# EAGLE design SparkFun RTK Facet - Display SD SIM (EAGLE 9.6.2)
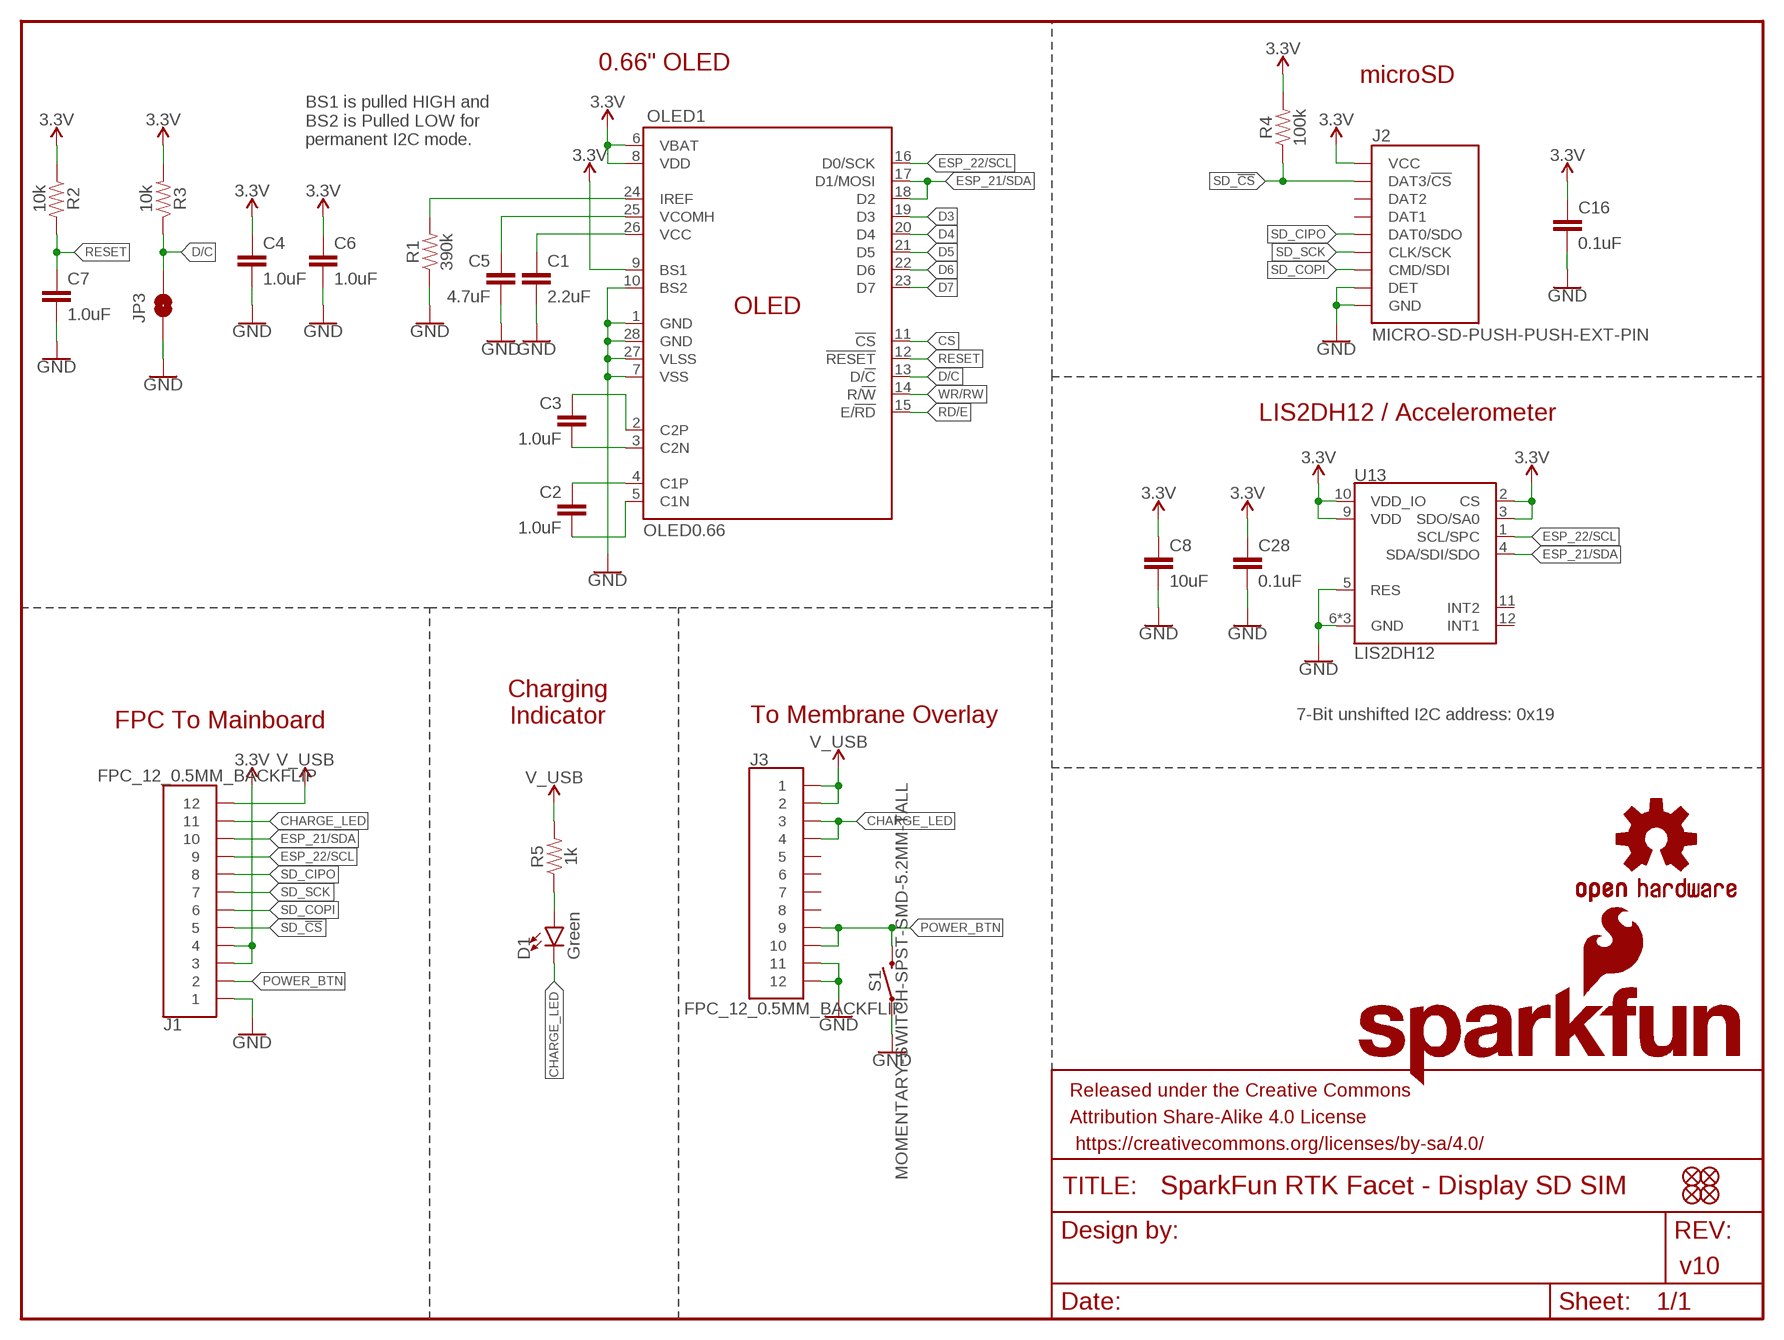
[diagram p0: schematic, sheet 1]

## Parts
C1  2.2uF  2.2UF-0805-25V-(+80/-20%)  [0805]
C2  1.0uF  1.0UF-0805-25V-10%  [0805]
C3  1.0uF  1.0UF-0805-25V-10%  [0805]
C4  1.0uF  1.0UF-0603-16V-10%  [0603]
C5  4.7uF  4.7UF-1206-16V-(+80/-20%)  [1206]
C6  1.0uF  1.0UF-0603-16V-10%  [0603]
C7  1.0uF  1.0UF-0603-16V-10%  [0603]
C8  10uF  10UF-0603-6.3V-20%  [0603]
C16  0.1uF  0.1UF-0603-25V-(+80/-20%)  [0603]
C28  0.1uF  0.1UF-0603-25V-(+80/-20%)  [0603]
D1  Green  LED-GREEN1206-BOTTOM  [LED-1206-BOTTOM]
FID1  FIDUCIAL1X2  [FIDUCIAL-1X2]
FID2  FIDUCIAL1X2  [FIDUCIAL-1X2]
FID3  FIDUCIAL1X2  [FIDUCIAL-1X2]
FID4  FIDUCIAL1X2  [FIDUCIAL-1X2]
FRAME1  FRAME-LETTER  [CREATIVE_COMMONS]
J1  FPC_12_0.5MM_BACKFLIP  [FPC_12_DOUBLESIDED_BACKFLIP]
J2  MICRO-SD-PUSH-PUSH-EXT-PIN  [MICROSD-EXTERNALPIN]
J3  FPC_12_0.5MM_BACKFLIP  [FPC_12_DOUBLESIDED_BACKFLIP]
JP3  JUMPER-SMT_2_NO_SILK  [SMT-JUMPER_2_NO_SILK]
LOGO3  OSHW-LOGOMINI  [OSHW-LOGO-MINI]
LOGO5  SFE_LOGO_NAME_FLAME.1_INCH  [SFE_LOGO_NAME_FLAME_.1]
OLED1  OLED0.66  [OLED-0.66-64X48]
R1  390k  390KOHM-0603-1/10W-1%  [0603]
R2  10k  10KOHM-0603-1/10W-1%  [0603]
R3  10k  10KOHM-0603-1/10W-1%  [0603]
R4  100k  100KOHM-0603-1/10W-1%  [0603]
R5  1k  1KOHM-0603-1/10W-1%  [0603]
S1  MOMENTARY-SWITCH-SPST-SMD-5.2MM-TALL  [TACTILE_SWITCH_SMD_5.2MM]
U13  LIS2DH12  [LGA-12-LISDH12]

## Nets
3.3V [power]: C4.1 C6.1 C8.1 C16.1 C28.1 J1.3 J1.4 J2.4(VCC) OLED1.6(VBAT) OLED1.8(VDD) OLED1.9(BS1) R2.1 R3.2 R4.2 U13.2(CS) U13.3(SDO/SA0) U13.9(VDD) U13.10(VDD_IO)
C1P: C2.1 OLED1.4(C1P)
C2N: C3.2 OLED1.3(C2N)
CHARGE_LED: D1.C J1.11 J3.3 J3.4
CS: OLED1.11(!CS!)
D3: OLED1.19(D3)
D4: OLED1.20(D4)
D5: OLED1.21(D5)
D6: OLED1.22(D6)
D7: OLED1.23(D7)
D/C: JP3.2 OLED1.13(D/!C!) R3.1
ESP_21/SDA: J1.10 OLED1.17(D1/MOSI) OLED1.18(D2) U13.4(SDA/SDI/SDO)
ESP_22/SCL: J1.9 OLED1.16(D0/SCK) U13.1(SCL/SPC)
GND: C1.2 C4.2 C5.2 C6.2 C7.2 C8.2 C16.2 C28.2 J1.1 J2.6(GND) J2.9(DET) J2.10(GND) J2.11(GND) J2.12(GND) J2.13(GND) J3.11 J3.12 JP3.1 OLED1.1(GND) OLED1.7(VSS) OLED1.10(BS2) OLED1.27(VLSS) OLED1.28(GND) R1.1 S1.1 U13.5(RES) U13.6(GND) U13.7(GND) U13.8(GND)
IREF: OLED1.24(IREF) R1.2
N$1: C3.1 OLED1.2(C2P)
N$2: C2.2 OLED1.5(C1N)
N$3: D1.A R5.1
POWER_BTN: J1.2 J3.9 J3.10 S1.3
RD/E: OLED1.15(E/!RD!)
RESET: C7.1 OLED1.12(!RESET!) R2.2
SD_!CS!: J1.5 J2.2(DAT3/!CS!) R4.1
SD_CIPO: J1.8 J2.7(DAT0/SDO)
SD_COPI: J1.6 J2.3(CMD/SDI)
SD_SCK: J1.7 J2.5(CLK/SCK)
V_USB: J1.12 J3.1 J3.2 R5.2
VCC: C1.1 OLED1.26(VCC)
VCOMH: C5.1 OLED1.25(VCOMH)
WR/RW: OLED1.14(R/!W!)
Unconnected: J2.1(DAT2) J2.8(DAT1) J3.5 J3.6 J3.7 J3.8 U13.11(INT2) U13.12(INT1)

## Notes on the sheet
- 0.66" OLED
- microSD
- BS1 is pulled HIGH and 
  BS2 is Pulled LOW for 
  permanent I2C mode.
- LIS2DH12 / Accelerometer
- Charging
  Indicator
- FPC To Mainboard | To Membrane Overlay | 7-Bit unshifted I2C address: 0x19
- v10

## Library data of the parts
C1 = SparkFun-Capacitors:2.2UF: 2.2µF ceramic capacitors A capacitor is a passive two-terminal electrical component used to store electrical energy temporarily in an electric field.; PROD_ID: CAP-11624
C2 C3 = SparkFun-Capacitors:1.0UF: 1µF ceramic capacitors A capacitor is a passive two-terminal electrical component used to store electrical energy temporarily in an electric field.; PROD_ID: CAP-08064
C4 C6 C7 = SparkFun-Capacitors:1.0UF: 1µF ceramic capacitors A capacitor is a passive two-terminal electrical component used to store electrical energy temporarily in an electric field.; PROD_ID: CAP-00868
C5 = SparkFun-Capacitors:4.7UF: 4.7µF ceramic capacitors A capacitor is a passive two-terminal electrical component used to store electrical energy temporarily in an electric field.; PROD_ID: CAP-10300
C8 = SparkFun-Capacitors:10UF: 10.0µF ceramic capacitors A capacitor is a passive two-terminal electrical component used to store electrical energy temporarily in an electric field.; PROD_ID: CAP-11015
C16 C28 = SparkFun-Capacitors:0.1UF: 0.1µF ceramic capacitors A capacitor is a passive two-terminal electrical component used to store electrical energy temporarily in an electric field.; PROD_ID: CAP-00810
D1 = SparkFun-LED:LED-GREEN: Green SMD LED Used in manufacturing of various products at SparkFun Packages: 0603 - SMD 0603 package [Product Link] <http://www.futureelectronics.com/en/technologies/semiconductors/optoelectronics/leds/Pages/9894312-LTST-C190GKT.aspx?CrossPart=HSMG-C190&IM=0> LilyPad 1206 - SMD1206 LilyPad package [Product Link] <http://www.futureelectronics.com/en/Technologies/Product.aspx?ProductID=IN150NGHARVATEKCORPORATION2049943&IM=0> 1206 - SMD1206 package [Product Link] <http://www.futureelectronics.com/en/technologies/semiconductors/optoelectronics/leds/Pages/8315665-LTST-C150KGKT.aspx?IM=0> 1206 Bottom Mount -SMD 1206 Bottom Mount [Product Link] <http://www.digikey.com/product-detail/en/lite-on-inc/LTST-C230KGKT/160-1456-1-ND/386854> SparkFun Products: Pro Mini 328 -5V <https://www.sparkfun.com/products/821> RedBoard <https://www.sparkfun.com/products/12757> MP3 Trigger <https://www.sparkfun.com/products/13720> Makey Makey <https://www.sparkfun.com/products/11076>; PROD_ID: DIO-11076
FID1-FID4 = SparkFun-Aesthetics:FIDUCIAL: Fiducial Alignment Points Point-of-reference for pick-and-place machines and other optical instruments.
FRAME1 = SparkFun-Aesthetics:FRAME-LETTER: Schematic Frame - Letter Standard 8.5x11 US Letter frame
J1 J3 = RTK Facet:FPC_12_0.5MM; PROD_ID: CONN-15766
J2 = SparkFun-Connectors:MICRO-SD: microSD Socket for Transflash Various sockets for µSD. tDoc lines correctly indicate media card edge positions when inserting (unlocked, locked, depressed). NOTE: CD1 and CD2 are connected internally, and the default detect state of the socket is detect pin to ground. SparkFun Products: WAV Trigger <https://www.sparkfun.com/products/13660> CAN-Bus Shield <https://www.sparkfun.com/products/13262> SparkFun Level Shifing microSD Breakout <https://www.sparkfun.com/products/13743>; PROD_ID: CONN-16110
JP3 = SparkFun-Jumpers:JUMPER-SMT_2_NO: Normally open jumper This jumper has two pads in close proximity to each other. Apply solder to close the connection. Round pads are easier to solder for beginners, but are a lot larger. SparkFun Product that uses the round pads: SparkFun EL Sequencer <https://www.sparkfun.com/products/12781>
LOGO3 = SparkFun-Aesthetics:OSHW-LOGO: Open-Source Hardware (OSHW) Logo This logo indicates the piece of hardware it is found on incorporates a OSHW license and/or adheres to the definition of open source hardware found here: http://freedomdefined.org/OSHW
LOGO5 = SparkFun-Aesthetics:SFE_LOGO_NAME_FLAME: SparkFun Font Logo w/ Flame This is the SparkFun full logo. The logo on the schematic will always be the same size; the package variant is the height of the flame part of the logo. Default layer for the logo on the board is tSilk.
OLED1 = SparkFun-Displays:OLED0.66: Micro OLED TODO: Add description SparkFun Products: Micro OLED Breakout <https://www.sparkfun.com/products/13003>; PROD_ID: LCD-12019
R1 = SparkFun-Resistors:390KOHM: 390kΩ resistor A resistor is a passive two-terminal electrical component that implements electrical resistance as a circuit element. Resistors act to reduce current flow, and, at the same time, act to lower voltage levels within circuits. - Wikipedia; PROD_ID: RES-12024
R2 R3 = SparkFun-Resistors:10KOHM: 10kΩ resistor A resistor is a passive two-terminal electrical component that implements electrical resistance as a circuit element. Resistors act to reduce current flow, and, at the same time, act to lower voltage levels within circuits. - Wikipedia; PROD_ID: RES-00824
R4 = SparkFun-Resistors:100KOHM: 100kΩ resistor A resistor is a passive two-terminal electrical component that implements electrical resistance as a circuit element. Resistors act to reduce current flow, and, at the same time, act to lower voltage levels within circuits. - Wikipedia; PROD_ID: RES-07828
R5 = SparkFun-Resistors:1KOHM: 1kΩ resistor A resistor is a passive two-terminal electrical component that implements electrical resistance as a circuit element. Resistors act to reduce current flow, and, at the same time, act to lower voltage levels within circuits. - Wikipedia; PROD_ID: RES-07856
S1 = SparkFun-Switches:MOMENTARY-SWITCH-SPST: Momentary Switch (Pushbutton) - SPST Normally-open (NO) SPST momentary switches (buttons, pushbuttons). Variants PTH-12MM - 12mm square, through-hole Momentary Pushbutton Switch - 12mm Square <https://www.sparkfun.com/products/9190> (COM-09190) PTH-6.0MM, PTH-6.0MM-KIT - 6.0mm square, through-hole Mini Pushbutton Switch <https://www.sparkfun.com/products/97> (COM-00097) KIT package intended for soldering kit's - only one side of pads' copper is exposed. PTH-RIGHT-ANGLE-KIT - Right-angle, through-hole Right Angle Tactile Button <https://www.sparkfun.com/products/10791> - Used on SparkFun BigTime Watch Kit <https://www.sparkfun.com/products/11734> SMD-12MM - 12mm square, surface-mount Tactile Button - SMD (12mm) <https://www.sparkfun.com/products/12993> (COM-12993) Used on SparkFun PicoBoard <https://www.sparkfun.com/products/11888> SMD-4.5MM - 4.5mm Square Trackball Switch Used on SparkFun Blackberry Trackballer Breakout <https://www.sparkfun.com/products/13169> SMD-4.6MMX2.8MM - 4.60mm x 2.80mm, surface mount Used on SparkFun Pro Micro - RP2040 <https://www.sparkfun.com/products/17717> SMD-5.2MM, SMD-5.2-REDUNDANT - 5.2mm square, surface-mount Mini Pushbutton Switch - SMD <https://www.sparkfun.com/products/8720> (COM-08720) Used on Arduino Pro Mini <https://www.sparkfun.com/products/11114> REDUNDANT package connects both switch circuits together SMD-6.0X3.5MM - 6.0 x 3.5mm, surface mount Momentary Reset Switch SMD <https://www.sparkfun.com/products/8229> (COM-08229) SMD-6.2MM-TALL - 6.2mm square, surface mount Tactile Button - SMD (6mm) <https://www.sparkfun.com/products/12992> Used on SparkFun Digital Sandbox <https://www.sparkfun.com/products/12651> SMD-RIGHT-ANGLE - Right-angle, surface mount Used on SparkFun Block for Intel® Edison - Arduino <https://www.sparkfun.com/products/13036>; PROD_ID: SWCH-14139
U13 = SparkFun-Sensors:LIS2DH12; DIGIKEY: 497-14851-2-ND; PROD_ID: IC-14229

## Net classes
0 default: width 0.127 mm
1 power: width 0.178 mm

## Board
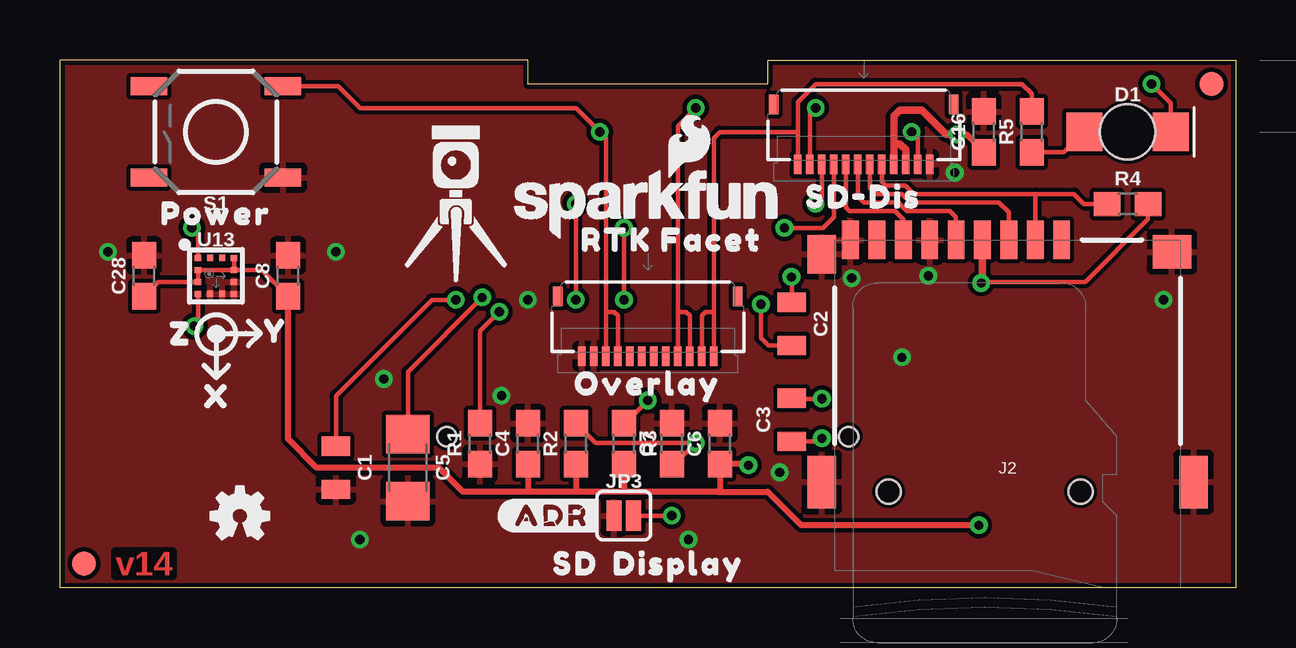
[diagram p1: board, top side]
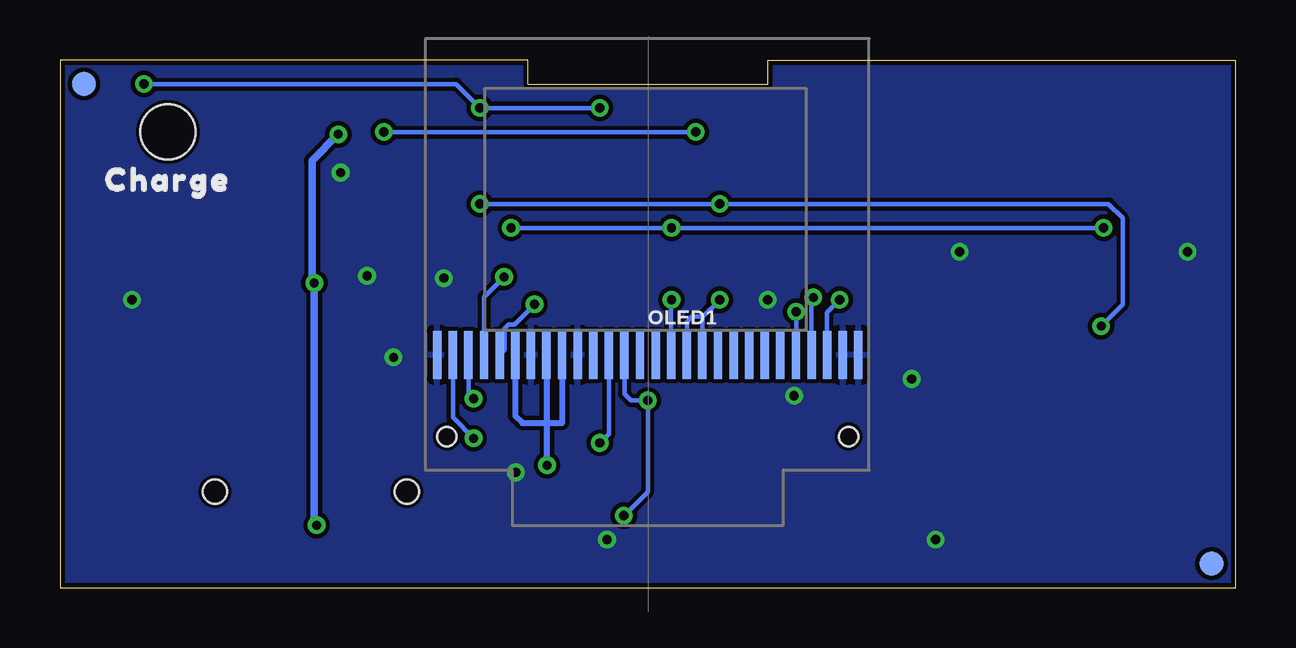
[diagram p2: board, bottom side, seen from below]

Size 49 x 22 mm. Coordinates in mm from the lower left corner, seen from the top.
Outline: 0,0 0,22 19.5,22 19.5,21 29.5,21 29.5,22 49,22 49,0 0,0
Copper layers (1*16): Top/Vert 0.035mm / dielectric 1.5mm / Bottom/Horz 0.035mm
Design rules "SparkFun-2-layer-TIGHT": minimum track width 7mil, minimum drill 15mil, track to track 7mil, track to pad 7mil, pad to pad 7mil, via to via 7mil, smd to smd 7mil, copper to edge 7mil, drill to drill 7mil, minimum pad ring 7mil, minimum via ring 7mil, stop-mask expansion 4mil, vias tented up to drill 25mil, thermal gap 10mil
tKeepout: area 47,0 to 49,22; area 0,0 to 2,22
bKeepout: area 47,0 to 49,22; area 0,0 to 2,22
tRestrict: area 21.9,9.5 to 22.1,9.8

### Footprints (pad centres in the part's own frame; a part is rotated, then mirrored left to right if it is on the bottom)
0805 = smd 0.8 x 1.2: 1 -0.9,0; 2 0.9,0
0603 = smd 1.1 x 1: 1 -0.85,0; 2 0.85,0
1206 = smd 1.6 x 1.8: 1 -1.4,0; 2 1.4,0
LED-1206-BOTTOM = smd 1.5 x 1.6: A -1.8,0; C 1.8,0 | hole 2.3: 0,0
FIDUCIAL-1X2 = smd 1 x 1: 1 0,0
FPC_12_DOUBLESIDED_BACKFLIP = smd 0.3 x 0.8: 1 -2.75,1.35; 2 -2.25,1.35; 3 -1.75,1.35; 4 -1.25,1.35; 5 -0.75,1.35; 6 -0.25,1.35; 7 0.25,1.35; 8 0.75,1.35; 9 1.25,1.35; 10 1.75,1.35; 11 2.25,1.35; 12 2.75,1.35 | smd 0.4 x 0.8: MP1 -3.75,-1.15; MP2 3.75,-1.15
MICROSD-EXTERNALPIN = smd 0.7 x 1.6: 1 2.25,10.5; 2 1.15,10.5; 3 0.05,10.5; 4 -1.05,10.5; 5 -2.15,10.5; 6 -3.25,10.5; 7 -4.35,10.5; 8 -5.45,10.5; 9 -6.55,10.5 | smd 1.2 x 1.6: 10 -7.75,9.9 | smd 1.2 x 2.2: 11 -7.75,0.4; 12 7.75,0.4 | smd 1.6 x 1.4: 13 6.85,10 | hole 1: 3.05,0; -4.95,0
SMT-JUMPER_2_NO_SILK = smd 0.635 x 1.27: 1 -0.406,0; 2 0.406,0
OLED-0.66-64X48 = smd 0.35 x 2: 1 -8.775,0; 2 -8.125,0; 3 -7.475,0; 4 -6.825,0; 5 -6.175,0; 6 -5.525,0; 7 -4.875,0; 8 -4.225,0; 9 -3.575,0; 10 -2.925,0; 11 -2.275,0; 12 -1.625,0; 13 -0.975,0; 14 -0.325,0; 15 0.325,0; 16 0.975,0; 17 1.625,0; 18 2.275,0; 19 2.925,0; 20 3.575,0; 21 4.225,0; 22 4.875,0; 23 5.525,0; 24 6.175,0; 25 6.825,0; 26 7.475,0; 27 8.125,0; 28 8.775,0 | hole 0.8: 8.375,-3.4; -8.375,-3.4
TACTILE_SWITCH_SMD_5.2MM = smd 1.524 x 0.762: 1 -2.794,1.905; 2 2.794,1.905; 3 -2.794,-1.905; 4 2.794,-1.905
LGA-12-LISDH12 = smd 0.275 x 0.25: 1 -0.75,0.75; 2 -0.75,0.25; 3 -0.75,-0.25; 4 -0.75,-0.75; 7 0.75,-0.75; 8 0.75,-0.25; 9 0.75,0.25; 10 0.75,0.75 | smd 0.25 x 0.275: 5 -0.25,-0.75; 6 0.25,-0.75; 11 0.25,0.75; 12 -0.25,0.75

### Placement (x,y rotation side)
C1  11.5,5 270 top
C2  30.5,11 270 top
C3  30.5,7 90 top
C4  19.5,6 90 top
C5  14.5,5 270 top
C6  27.5,6 90 top
C7  25.5,6 90 top
C8  9.5,13 90 top
C16  38.5,19 90 top
C28  3.5,13 90 top
D1  44.5,19 0 top
FID1  1,1 0 bottom
FID2  48,21 0 bottom
FID3  48,21 0 top
FID4  1,1 0 top
FRAME1  52.57,-29.5 0 bottom  (outside the outline)
J1  33.5,19 180 top
J2  39.5,4 0 top
J3  24.5,11 180 top
JP3  23.5,3 0 top
LOGO3  7.5,3 0 top
LOGO5  24.5,16 0 top
OLED1  24.5,9.7 0 bottom
R1  17.5,6 90 top
R2  21.5,6 90 top
R3  23.5,6 270 top
R4  44.5,16 0 top
R5  40.5,19 90 top
S1  6.5,19 180 top
U13  6.5,13 0 top
U$1  [SD#DIS0]  33.5,16.3 0 top
U$2  [OVERLAY0]  24.5,8.5 0 top
U$3  [DISPLAY0]  25.8,1 0 top
U$4  [SD1]  21.5,1 0 top
U$5  [RTK5#SVG0]  16.5,16 0 top
U$7  [#ADR#0]  20.5,3 0 top
U$8  [CHARGE0]  44.5,17 0 bottom
U$9  [POWER0]  6.5,15.6 0 top
U$10  [X0]  6.4,8 180 top
U$11  [Y1]  9,10.7 0 top
U$12  [Z2]  4.9,10.6 180 top
U$13  [RTK_FACET0]  25.5,14.5 0 top

### Tracks (layer width: path | path; a pad name or v marks a point on that pad's centre or on a via)
3.3V  (via drill 0.38)
  Top/Vert 0.178: C28.1 4.1,12.75 U13.3 U13.2 U13.9 | U13.9 U13.10 | U13.9 8.4,13.25 C8.1 | R4.2 45.35,15.37 42.73,12.75 38.45,12.75
  Top/Vert 0.254: 27.4,4 29.5,4 30.9,2.6 v38.3,2.6 | 27.4,4 27.5,4.1 C6.1 28.65,5.15 v28.7,5.1 | C8.1 9.5,6.2 10.7,5 15.8,5 16.8,4 19.5,4 | 27.4,4 23.5,4 | 23.5,4 21.5,4 | 21.5,4 19.5,4 | C4.1 19.5,4 | R2.1 21.5,4 | R3.2 23.5,4 | C16.1 38.5,18.18 37.78,18.9 v37.4,18.9
  Top/Vert 0.305: J1.4 34.75,18.5 | 34.75,18.5 34.75,19.65 35,19.9 35.93,19.9 36.93,18.9 v37.4,18.9 | J2.4 38.45,12.75 v38.4,12.7 | 34.75,18.5 35.01,18.5 35.25,18.26 J1.3
  Bottom/Horz 0.254: OLED1.9 28.07,6.86 28.71,6.86 | OLED1.6 30.02,7.16 29.73,6.86 28.71,6.86 | OLED1.8 28.73,6.87 28.71,6.86 | v28.7,5.1 28.7,6.85 28.71,6.86
  Bottom/Horz 0.305: v37.4,18.9 38.5,17.8 38.5,12.8 v38.4,12.7 38.4,2.7 v38.3,2.6
C1P  (via drill 0.38)
  Top/Vert 0.178: C2.1 v30.5,12.94 v30.49,12.95
  Bottom/Horz 0.178: v30.49,12.95 31.32,12.12 OLED1.4
C2N  (via drill 0.38)
  Top/Vert 0.178: C3.2 30.53,7.87 v31.76,7.87
  Bottom/Horz 0.178: v31.76,7.87 31.98,8.09 OLED1.3
CHARGE_LED  (via drill 0.38)
  Top/Vert 0.178: D1.C 46.3,20.2 v45.5,21 | J1.11 31.25,19.75 v31.5,20 | 25.75,11.5 25.75,19.25 v26.5,20 | 25.75,11.5 J3.4 | 25.75,11.5 26.1,11.5 26.25,11.35 J3.3
  Bottom/Horz 0.178: v45.5,21 32.5,21 v31.5,20 v26.5,20
D/C  (via drill 0.38)
  Top/Vert 0.178: R3.1 23.55,6.85 v24.5,7.8 | JP3.2 v25.5,3
  Bottom/Horz 0.178: v25.5,3 24.5,4 v24.5,7.8 25.2,7.8 25.48,8.07 OLED1.13
ESP_21/SDA  (via drill 0.38)
  Top/Vert 0.178: J1.10 31.75,16.25 v31.5,16 | v21.5,12 v21.5,16 | U13.4 5.75,11.05 v5.6,10.9
  Bottom/Horz 0.178: v31.5,16 v21.5,16 5.3,16 4.7,15.4 4.7,11.8 v5.6,10.9 | OLED1.18 22.23,11.28 | 22.23,11.28 v21.5,12 | OLED1.17 22.88,11.07 22.65,11.3 22.25,11.3 22.23,11.28
ESP_22/SCL  (via drill 0.38)
  Top/Vert 0.178: J1.9 32.25,15.45 31.8,15 v30.2,15 | v23.51,12 v23.51,15 | U13.1 5.75,14.75 v5.5,15
  Bottom/Horz 0.178: OLED1.16 23.52,11.98 v23.51,12 | v30.2,15 v23.51,15 v5.5,15
GND  (via drill 0.38)
  other vias: 35.1,9.6 26.2,2 19.5,12 12.5,2 11.5,14 2,14 36.2,13 46,12 13.5,8.7 33,12.9 37.3,17.3 18.4,8 30,4.8
  pour Top/Vert (isolate 0.152): 0,0 0,22 49,22 49,0
  pour Bottom/Horz (isolate 0.152): 0,0 0,22 49,22 49,0
IREF  (via drill 0.38)
  Top/Vert 0.178: R1.2 17.5,10.69 v18.31,11.5
  Bottom/Horz 0.178: v18.31,11.5 18.31,9.71 OLED1.24
N$1  (via drill 0.38)
  Top/Vert 0.178: C3.1 31.64,6.1 v31.76,6.22
  Bottom/Horz 0.178: v31.76,6.22 32.62,7.09 OLED1.2
N$2  (via drill 0.38)
  Top/Vert 0.178: v29.22,11.81 29.22,10.41 29.53,10.1 C2.2
  Bottom/Horz 0.178: OLED1.5 30.47,9.91 30.47,10.81 30.31,10.97 30.06,10.97 v29.22,11.81
N$3
  Top/Vert 0.178: R5.1 41.85,18.15 D1.A
POWER_BTN  (via drill 0.38)
  Top/Vert 0.178: J3.10 22.75,11.5 | 22.75,11.5 22.75,18.75 v22.5,19 21.5,20 12.5,20 11.6,20.91 S1.3 | J3.9 23.25,11.35 23.1,11.5 22.75,11.5 | J1.2 35.75,18.75 v35.5,19
  Bottom/Horz 0.178: v35.5,19 v22.5,19
RESET  (via drill 0.38)
  Top/Vert 0.178: C7.1 25.62,5.15 v26.5,6.03 22.32,6.03 R2.2
  Bottom/Horz 0.178: v26.5,6.03 26.12,6.4 OLED1.12
SD_!CS!
  Top/Vert 0.178: J1.5 34.25,16.92 34.4,16.77 35.24,16.77 35.6,16.41 40.65,16.41 | J2.2 40.65,15.24 40.65,16.41 | R4.1 42.68,16 42.27,16.41 40.65,16.41
SD_CIPO
  Top/Vert 0.178: J1.8 32.75,15.85 32.9,15.7 34.8,15.7 35.15,15.35 J2.7
SD_COPI
  Top/Vert 0.178: J1.6 33.75,16.66 34,16.41 35.09,16.41 35.45,16.06 39.14,16.06 39.55,15.65 J2.3
SD_SCK
  Top/Vert 0.178: J1.7 33.25,16.31 33.5,16.06 34.95,16.06 35.3,15.7 37.1,15.7 37.35,15.45 J2.5
V_USB
  Top/Vert 0.178: J1.12 30.75,19 | 30.75,19 30.75,20.25 31.5,21 40.1,21 40.5,20.6 R5.2 | J3.1 27.25,11.5 | 27.25,11.5 27.25,18.75 27.5,19 30.75,19 | J3.2 26.75,11.35 26.9,11.5 27.25,11.5
VCC  (via drill 0.38)
  Top/Vert 0.178: v16.5,12 15.5,12 11.5,8 C1.1
  Bottom/Horz 0.178: OLED1.26 17.02,11.47 v16.5,12
VCOMH  (via drill 0.38)
  Top/Vert 0.178: C5.1 14.5,9 v17.6,12.1
  Bottom/Horz 0.178: OLED1.25 17.68,12.03 v17.6,12.1

### Text on the board
Top/Vert: v14
tDocu: FPC stiffener is 3mm